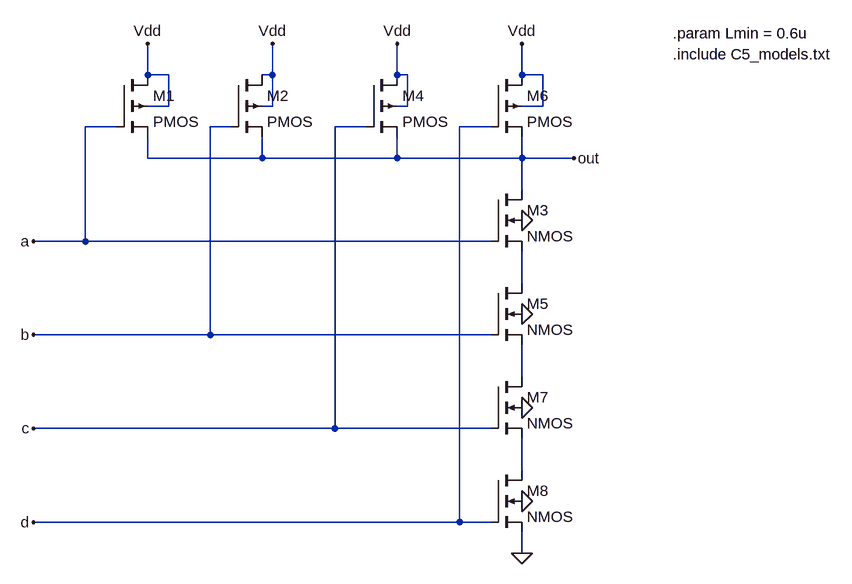
[diagram p0: schematic NAND4.asc]
NAND4.asc, the LTspice schematic file:
Version 4
SHEET 1 936 852
WIRE -576 96 -576 48
WIRE -544 96 -576 96
WIRE -384 96 -384 48
WIRE -384 96 -400 96
WIRE -192 96 -192 48
WIRE -176 96 -192 96
WIRE 0 96 0 48
WIRE 32 96 0 96
WIRE -544 144 -544 96
WIRE -544 144 -576 144
WIRE -384 144 -384 96
WIRE -384 144 -400 144
WIRE -176 144 -176 96
WIRE -176 144 -192 144
WIRE 32 144 32 96
WIRE 32 144 0 144
WIRE -624 176 -672 176
WIRE -448 176 -480 176
WIRE -240 176 -288 176
WIRE -48 176 -96 176
WIRE -576 224 -576 192
WIRE -400 224 -400 192
WIRE -400 224 -576 224
WIRE -192 224 -192 192
WIRE -192 224 -400 224
WIRE 0 224 0 192
WIRE 0 224 -192 224
WIRE 80 224 0 224
WIRE 0 272 0 224
WIRE -672 352 -672 176
WIRE -672 352 -752 352
WIRE -48 352 -672 352
WIRE 0 416 0 368
WIRE -480 496 -480 176
WIRE -480 496 -752 496
WIRE -48 496 -480 496
WIRE 0 560 0 512
WIRE -288 640 -288 176
WIRE -288 640 -752 640
WIRE -48 640 -288 640
WIRE 0 704 0 656
WIRE -96 784 -96 176
WIRE -96 784 -752 784
WIRE -48 784 -96 784
WIRE 0 832 0 800
FLAG -384 48 Vdd
FLAG -192 48 Vdd
FLAG 0 48 Vdd
FLAG -576 48 Vdd
FLAG 0 832 0
FLAG 0 752 0
FLAG 0 608 0
FLAG 0 464 0
FLAG 0 320 0
FLAG 80 224 out
FLAG -752 352 a
FLAG -752 496 b
FLAG -752 640 c
FLAG -752 784 d
SYMBOL pmos4 -448 96 R0
SYMATTR InstName M2
SYMATTR Value2 l='Lmin' w='Wpmos1' ad='Lmin*Wpmos1' as='Lmin*Wpmos1' pd='2*(Lmin+Wpmos1)' ps='2*(Lmin+Wpmos1)' m=1
SYMBOL pmos4 -240 96 R0
SYMATTR InstName M4
SYMATTR Value2 l='Lmin' w='Wpmos1' ad='Lmin*Wpmos1' as='Lmin*Wpmos1' pd='2*(Lmin+Wpmos1)' ps='2*(Lmin+Wpmos1)' m=1
SYMBOL pmos4 -48 96 R0
SYMATTR InstName M6
SYMATTR Value2 l='Lmin' w='Wpmos1' ad='Lmin*Wpmos1' as='Lmin*Wpmos1' pd='2*(Lmin+Wpmos1)' ps='2*(Lmin+Wpmos1)' m=1
SYMBOL pmos4 -624 96 R0
SYMATTR InstName M1
SYMATTR Value2 l='Lmin' w='Wpmos1' ad='Lmin*Wpmos1' as='Lmin*Wpmos1' pd='2*(Lmin+Wpmos1)' ps='2*(Lmin+Wpmos1)' m=1
SYMBOL nmos4 -48 272 R0
SYMATTR InstName M3
SYMATTR Value2 l='Lmin' w='Wnmos1' ad='Lmin*Wnmos1' as='Lmin*Wnmos1' pd='2*(Lmin+Wnmos1)' ps='2*(Lmin+Wnmos1)' m=1
SYMBOL nmos4 -48 416 R0
SYMATTR InstName M5
SYMATTR Value2 l='Lmin' w='Wnmos1' ad='Lmin*Wnmos1' as='Lmin*Wnmos1' pd='2*(Lmin+Wnmos1)' ps='2*(Lmin+Wnmos1)' m=1
SYMBOL nmos4 -48 560 R0
SYMATTR InstName M7
SYMATTR Value2 l='Lmin' w='Wnmos1' ad='Lmin*Wnmos1' as='Lmin*Wnmos1' pd='2*(Lmin+Wnmos1)' ps='2*(Lmin+Wnmos1)' m=1
SYMBOL nmos4 -48 704 R0
SYMATTR InstName M8
SYMATTR Value2 l='Lmin' w='Wnmos1' ad='Lmin*Wnmos1' as='Lmin*Wnmos1' pd='2*(Lmin+Wnmos1)' ps='2*(Lmin+Wnmos1)' m=1
TEXT 232 64 Left 2 !.include C5_models.txt
TEXT 232 32 Left 2 !.param Lmin = 0.6u

The netlist it stands for:
* NAND4.asc
M2 Vdd b out Vdd PMOS l='Lmin' w='Wpmos1' ad='Lmin*Wpmos1' as='Lmin*Wpmos1' pd='2*(Lmin+Wpmos1)' ps='2*(Lmin+Wpmos1)' m=1
M4 Vdd c out Vdd PMOS l='Lmin' w='Wpmos1' ad='Lmin*Wpmos1' as='Lmin*Wpmos1' pd='2*(Lmin+Wpmos1)' ps='2*(Lmin+Wpmos1)' m=1
M6 Vdd d out Vdd PMOS l='Lmin' w='Wpmos1' ad='Lmin*Wpmos1' as='Lmin*Wpmos1' pd='2*(Lmin+Wpmos1)' ps='2*(Lmin+Wpmos1)' m=1
M1 Vdd a out Vdd PMOS l='Lmin' w='Wpmos1' ad='Lmin*Wpmos1' as='Lmin*Wpmos1' pd='2*(Lmin+Wpmos1)' ps='2*(Lmin+Wpmos1)' m=1
M3 out a N001 0 NMOS l='Lmin' w='Wnmos1' ad='Lmin*Wnmos1' as='Lmin*Wnmos1' pd='2*(Lmin+Wnmos1)' ps='2*(Lmin+Wnmos1)' m=1
M5 N001 b N002 0 NMOS l='Lmin' w='Wnmos1' ad='Lmin*Wnmos1' as='Lmin*Wnmos1' pd='2*(Lmin+Wnmos1)' ps='2*(Lmin+Wnmos1)' m=1
M7 N002 c N003 0 NMOS l='Lmin' w='Wnmos1' ad='Lmin*Wnmos1' as='Lmin*Wnmos1' pd='2*(Lmin+Wnmos1)' ps='2*(Lmin+Wnmos1)' m=1
M8 N003 d 0 0 NMOS l='Lmin' w='Wnmos1' ad='Lmin*Wnmos1' as='Lmin*Wnmos1' pd='2*(Lmin+Wnmos1)' ps='2*(Lmin+Wnmos1)' m=1
.model NMOS NMOS
.model PMOS PMOS
.lib standard.mos
.include C5_models.txt
.param Lmin = 0.6u
.backanno
.end